# Altium schematic sheet NuPrism_MCPMT - ADA4945-1 and Filter - Rev2.SchDoc: NuPrism Multichannel PMT - ADA4932-1 and Filter
size A; DrawnBy: D.Bishop; DocumentNumber: 8; Revision: 2; SheetNumber: 8; SheetTotal: 20
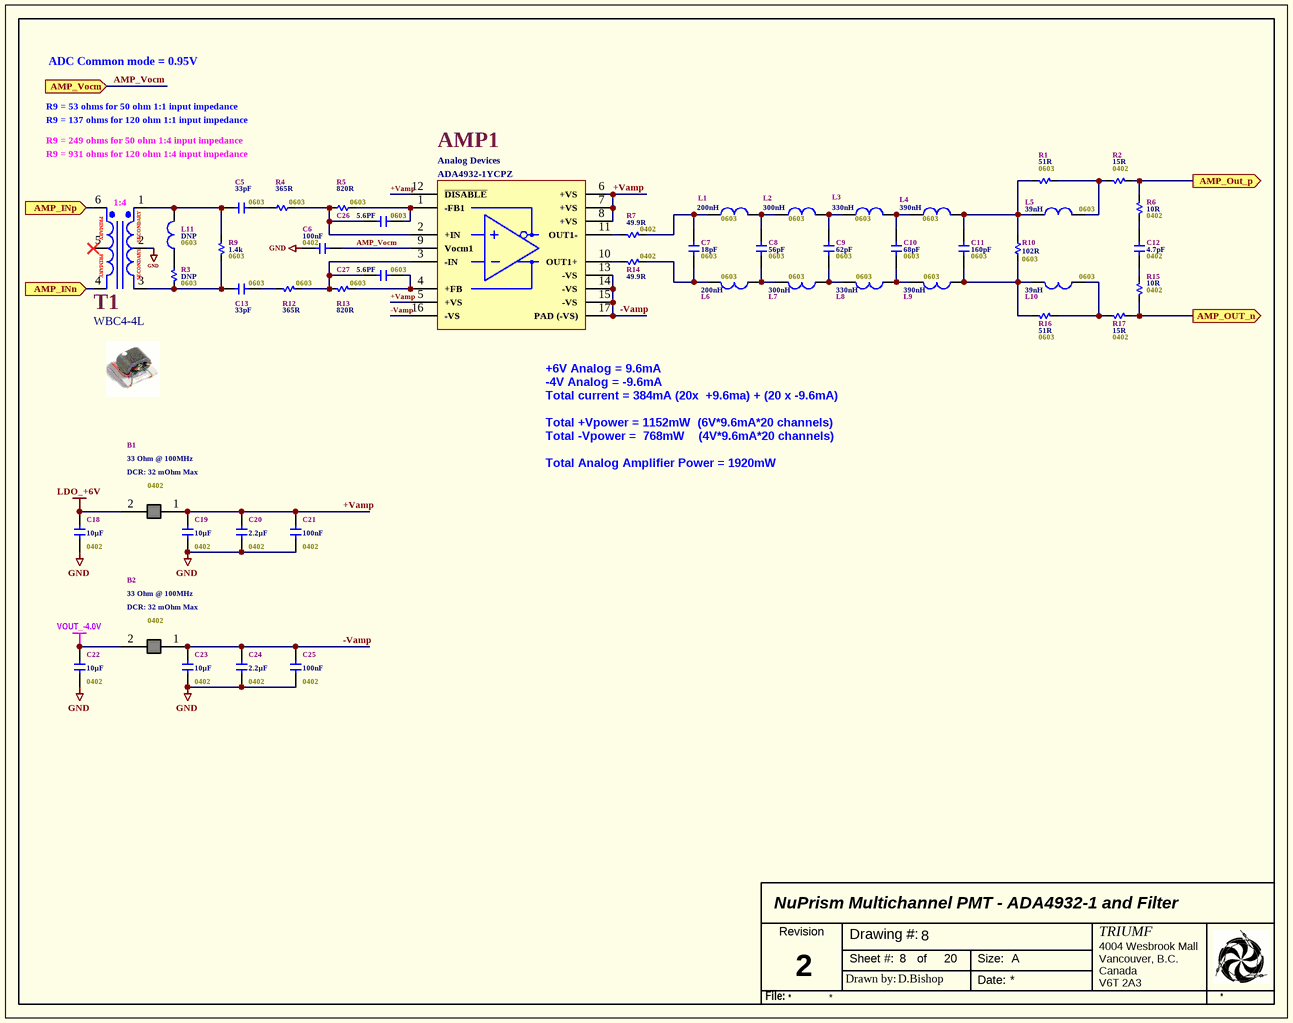
[diagram p0: NuPrism_MCPMT - ADA4945-1 and Filter - Rev2.SchDoc]

## Parts
AMP1  Manufacturer: Analog Devices  [QFN50P300X300X100-16N_ALT]  (hidden comment: ADA4932-1YCPZ)
B1  DCR: 32 mOhm Max  Impedance @ Frequency: 33 Ohm @ 100MHz  [0402]  (hidden comment: BLM15PX600SN1D)
B2  DCR: 32 mOhm Max  Impedance @ Frequency: 33 Ohm @ 100MHz  [0402]  (hidden comment: BLM15PX600SN1D)
C5  Capacitance: 33pF  [0603]  (hidden comment: C0603C330J1GAC7867)
C6  Capacitance: 100nF  [0402]  (hidden comment: C0402C104K4RACTU)
C7  Capacitance: 18pF  [0603]  (hidden comment: CC0603JPNPO9BN180)
C8  Capacitance: 56pF  [0603]  (hidden comment: C0603C560J5GAC7867)
C9  Capacitance: 62pF  [0603]  (hidden comment: CC0603JRNPO9BN620)
C10  Capacitance: 68pF  [0603]  (hidden comment: CC0603JRNPO9BN680)
C11  Capacitance: 160pF  [0603]  (hidden comment: CC0603JRNPO9BN161)
C12  Capacitance: 4.7pF  [0402]  (hidden comment: CC0402BRNPO9BN4R7)
C13  Capacitance: 33pF  [0603]  (hidden comment: C0603C330J1GAC7867)
C18  Capacitance: 10µF  [0402]  (hidden comment: CL05A106MQ5NRNC)
C19  Capacitance: 10µF  [0402]  (hidden comment: CL05A106MQ5NRNC)
C20  Capacitance: 2.2µF  [0402]  (hidden comment: TMK105CBJ225KV-F)
C21  Capacitance: 100nF  [0402]  (hidden comment: C0402C104K4RACTU)
C22  Capacitance: 10µF  [0402]  (hidden comment: CL05A106MQ5NRNC)
C23  Capacitance: 10µF  [0402]  (hidden comment: CL05A106MQ5NRNC)
C24  Capacitance: 2.2µF  [0402]  (hidden comment: TMK105CBJ225KV-F)
C25  Capacitance: 100nF  [0402]  (hidden comment: C0402C104K4RACTU)
C26  Capacitance: 5.6PF  [0603]  (hidden comment: 06035A5R6JAT2A)
C27  Capacitance: 5.6PF  [0603]  (hidden comment: 06035A5R6JAT2A)
L1  Package: 0603  Inductance: 200nH  [0603 - Inductor]  (hidden comment: LQW18ANR20J8ZD)
L2  Package: 0603  Inductance: 300nH  [0603 - Inductor]  (hidden comment: LQW18ANR30G80D)
L3  Package: 0603  Inductance: 330nH  [0603 - Inductor]  (hidden comment: LQW18CNR33J00D)
L4  Package: 0603  IndUctance: 390nH  [0603 - inductor]  (hidden comment: MLJ1608WR39JT000)
L5  Package: 0603  Inductance: 39nH  [0603 - Inductor_2]  (hidden comment: LQW18AN39NJ00D)
L6  Package: 0603  Inductance: 200nH  [0603 - Inductor]  (hidden comment: LQW18ANR20J8ZD)
L7  Package: 0603  Inductance: 300nH  [0603 - Inductor]  (hidden comment: LQW18ANR30G80D)
L8  Package: 0603  Inductance: 330nH  [0603 - Inductor]  (hidden comment: LQW18CNR33J00D)
L9  Package: 0603  Inductance: 390nH  [0603 - inductor]  (hidden comment: MLJ1608WR39JT000)
L10  Package: 0603  Inductance: 39nH  [0603 - Inductor_2]  (hidden comment: LQW18AN39NJ00D)
L11  Package: 0603  Inductance: DNP  [0603 - Inductor]
R1  Resistance: 51R  [0603]  (hidden comment: RC0603FR-0751RL)
R2  Resistance: 15R  [0402]  (hidden comment: RMCF0402FT15R0)
R3  Resistance: DNP  [0603]
R4  Resistance: 365R  [0603]  (hidden comment: ERJ-PB3B3650V)
R5  Resistance: 820R  [0603]  (hidden comment: RT0603BRD07820RL)
R6  Resistance: 10R  [0402]  (hidden comment: RC0402FR-0710RL)
R7  Resistance: 49.9R  [0402]  (hidden comment: RMCF0402FT49R9)
R9  Resistance: 1.4k  [0603]  (hidden comment: RC0603FR-101K4L)
R10  Resistance: 102R  [0603]  (hidden comment: RC0603FR-07102RL)
R12  Resistance: 365R  [0603]  (hidden comment: ERJ-PB3B3650V)
R13  Resistance: 820R  [0603]  (hidden comment: RT0603BRD07820RL)
R14  Resistance: 49.9R  [0402]  (hidden comment: RMCF0402FT49R9)
R15  Resistance: 10R  [0402]  (hidden comment: RC0402FR-0710RL)
R16  Resistance: 51R  [0603]  (hidden comment: RC0603FR-0751RL)
R17  Resistance: 15R  [0402]  (hidden comment: RMCF0402FT15R0)
T1  WBC4-4L  [WBC4-4WL]

## Ports
AMP_INn (in), AMP_INp (in), AMP_OUT_n (out), AMP_Out_p (out), AMP_Vocm (in)

## Nets
GND: C6.1 C18.1 C19.1 C20.2 C21.2 C22.1 C23.1 C24.2 C25.2 T1.2(SecCT)
LDO_+6V: B1.2 C18.2
VOUT_-4.0V: B2.2 C22.2
+Vamp: AMP1.5(+VS) AMP1.6(+VS) AMP1.7(+VS) AMP1.8(+VS) AMP1.12(~{DISABLE}) B1.1 C19.2 C20.1 C21.1
-Vamp: AMP1.13(-VS) AMP1.14(-VS) AMP1.15(-VS) AMP1.16(-VS) AMP1.17(PAD_(-VS)) B2.1 C23.2 C24.1 C25.1
AMP_INn: T1.4(Pri-) ; port AMP_INn
AMP_INp: T1.6(Pri+) ; port AMP_INp
AMP_OUT_n: R15.1 R17.2 ; port AMP_OUT_n
AMP_Out_p: R2.2 R6.2 ; port AMP_Out_p
AMP_Vocm: AMP1.9(Vocm1) C6.2 ; port AMP_Vocm
NetAMP1_1: AMP1.1(-FB1) C26.1 R5.1
NetAMP1_2: AMP1.2(+IN) C26.2 R4.1 R5.2
NetAMP1_3: AMP1.3(-IN) C27.2 R12.1 R13.2
NetAMP1_4: AMP1.4(+FB) C27.1 R13.1
NetAMP1_10: AMP1.10(OUT1+) R14.2
NetAMP1_11: AMP1.11(OUT1-) R7.2
NetC5_1: C5.1 L11.2 R9.1 T1.1(Sec+)
NetC5_2: C5.2 R4.2
NetC7_1: C7.1 L6.1 R14.1
NetC7_2: C7.2 L1.1 R7.1
NetC8_1: C8.1 L6.2 L7.1
NetC8_2: C8.2 L1.2 L2.1
NetC9_1: C9.1 L7.2 L8.1
NetC9_2: C9.2 L2.2 L3.1
NetC10_1: C10.1 L8.2 L9.1
NetC10_2: C10.2 L3.2 L4.1
NetC11_1: C11.1 L9.2 L10.1 R10.2 R16.1
NetC11_2: C11.2 L4.2 L5.1 R1.1 R10.1
NetC12_1: C12.1 R15.2
NetC12_2: C12.2 R6.1
NetC13_1: C13.1 R3.2 R9.2 T1.3(Sec-)
NetC13_2: C13.2 R12.2
NetL5_2: L5.2 R1.2 R2.1
NetL10_2: L10.2 R16.2 R17.1
NetL11_1: L11.1 R3.1

Not connected (* = marked no-connect by the designer): T1 5(PriCT)*

## Notes on the sheet
- ADC Common mode = 0.95V
- R9 = 249 ohms for 50 ohm 1:4 input impedance
- R9 = 931 ohms for 120 ohm 1:4 input impedance
- R9 = 53 ohms for 50 ohm 1:1 input impedance
- R9 = 137 ohms for 120 ohm 1:1 input impedance
- (near AMP1) +6V Analog = 9.6mA
- Total +Vpower = 1152mW  (6V*9.6mA*20 channels)
- Total current = 384mA (20x  +9.6ma) + (20 x -9.6mA)
- -4V Analog = -9.6mA
- Total -Vpower =  768mW    (4V*9.6mA*20 channels)
- Total Analog Amplifier Power = 1920mW
- Revision
- Sheet #:
- Drawing #:
- of
- Size:
- A
- TRIUMF
- 4004 Wesbrook Mall
- Vancouver, B.C.
- Canada
- File:
- Drawn by:
- Date:
- V6T 2A3
- (in symbol WBC4-4L) 1:4; PRIMARY; SECONDARY

## Library data of the parts
AMP1 = ADA4932-1YCPZ_ALT: High Speed, ±0.1 µV/˚C Offset Drift, Fully Differential ADC Driver; PartNo: ADA4932-1YCPZ; Family: Semiconductor
B1 B2 = Ferrite Bead: 60 Ohms @ 100MHz Ferrite Bead 0402 2.5A; Manufacturer: Murata; Package: 0402; PartNo: BLM15PX600SN1D; Family: Bead; Case Code (Imperial): 0402; Case Code (Metric): 1005
C5 C13 = CAP-SMALL: 33 pF ±5% 100V Ceramic Capacitor C0G, NP0 0603; Manufacturer: KEMET; Package: 0603; Voltage: 100V; PartNo: C0603C330J1GAC7867; Case Code (Imperial): 0603; Family: Capacitor; Case Code (Metric): 1608; DB_On_Order: DigiKey 8000
C6 C21 C25 = CAP-SMALL: SMD/SMT 0402 16V 0.1uF X7R 10%; Manufacturer: Kemet; Package: 0402; Voltage: 16V; PartNo: C0402C104K4RACTU; Case Code (Imperial): 0402; Family: Capacitor; Case Code (Metric): 1005
C7 = CAP-SMALL: 18 pF ±5% 50V Ceramic Capacitor C0G, NP0 0603; Manufacturer: Yageo; Package: 0603; PartNo: CC0603JPNPO9BN180; Case Code (Imperial): 0603; Family: Capacitor; Case Code (Metric): 1608; Supplier 1: Digi-Key; Supplier Part Number 1: 13-CC0603JPNPO9BN180TR-ND; Voltage: 50V; DB_On_Order: DigiReel 2300
C8 = CAP-SMALL: 56 pF ±5% 50V Ceramic Capacitor C0G, NP0 0603 (1608 Metric); Manufacturer: KEMET; Package: 0603; PartNo: C0603C560J5GAC7867; Case Code (Imperial): 0603; Family: Capacitor; Case Code (Metric): 1608; Voltage: 50V; DB_On_Order: DigiKey 4000
C9 = CAP-SMALL: 62 pF ±5% 50V Ceramic Capacitor C0G, NP0 0603 (1608 Metric); Manufacturer: YAGEO; Package: 0603; PartNo: CC0603JRNPO9BN620; Case Code (Imperial): 0603; Family: Capacitor; Case Code (Metric): 1608; Voltage: 50V; DB_On_Order: DigiReel 2300
C10 = CAP-SMALL: CAP CER 68PF 50V C0G/NPO 0603 (1608 Metric); Manufacturer: Yageo; Package: 0603; PartNo: CC0603JRNPO9BN680; Case Code (Imperial): 0603; Family: Capacitor; Case Code (Metric): 1608; Voltage: 50V
C11 = CAP-SMALL: 160 pF ±5% 50V Ceramic Capacitor C0G, NP0 0603 (1608 Metric); Manufacturer: YAGEO; Package: 0603; PartNo: CC0603JRNPO9BN161; Case Code (Imperial): 0603; Family: Capacitor; Case Code (Metric): 1608; Voltage: 50V; DB_On_Order: DigiReel 2300
C12 = CAP-SMALL: 4.7pF ±0.1pF 50V Ceramic Capacitor C0G, NP0 0402; Manufacturer: Yageo; Package: 0402; Voltage: 50V; PartNo: CC0402BRNPO9BN4R7; Family: Capacitor; Case Code (Imperial): 0402; Case Code (Metric): 1005
C18 C19 C22 C23 = ECJ2FB1A106K: 10 µF ±20% 6.3V Ceramic Capacitor X5R 0402 (1005 Metric); Manufacturer: Samsung Electro-Mechanics; Package: 0402; Voltage: 6.3V; PartNo: CL05A106MQ5NRNC; Family: Capacitor; Case Code (Imperial): 0402; Case Code (Metric): 1005
C20 C24 = CAP-SMALL: SMD/SMT 0402 25V 2.2uF 10% X5R; Manufacturer: Taiyo Yuden; Package: 0402; Voltage: 25V; PartNo: TMK105CBJ225KV-F; Family: Capacitor; Case Code (Imperial): 0402; Case Code (Metric): 1005
C26 C27 = CAP-SMALL: 5.6 pF ±5% 50V Ceramic Capacitor C0G, NP0 0603; Manufacturer: KYOCERA AVX; PartNo: 06035A5R6JAT2A; Case Code (Imperial): 0603; Package: 0603; Family: Capacitor; Voltage: 50V; Case Code (Metric): 1608; DB_On_Order: DigiKey 4300
L1 L6 = Inductor1: 200 nH Unshielded Wirewound Inductor 120 mA 2.40Ohm Max 0603; Manufacturer: Murata Electronics; PartNo: LQW18ANR20G00D; DCR: 1.74; DB_On_Order: Check if DCR is OK (Digi-Key); Family: Inductor; Case Code (Imperial): 0603; Case Code (Metric): 1608
L2 L7 = Inductor1: 300 nH Unshielded Wirewound Inductor 220 mA 3.12Ohm Max 0603; Manufacturer: Coilcraft; PartNo: LQW18ANR30G8ZD; DB_On_Order: Check if DCR is OK (Mouser); Family: Inductor; DCR: 3.12 Ohm; Case Code (Imperial): 0603; Case Code (Metric): 1608
L3 L8 = Inductor1: 330 nH Unshielded Drum Core, Wirewound Inductor 630 mA 250mOhm Max 0603; Manufacturer: Murata Electronics; PartNo: LQW18CNR33J00D; Family: Inductor; DCR: 250 mOhm; Case Code (Imperial): 0603; Case Code (Metric): 1608; DB_On_Order: DigiKey 4300
L4 L9 = Inductor1: 390 nH Shielded Multilayer Inductor 450 mA 364mOhm Max 0603 (1608 Metric); Manufacturer: TDK Corporation; PartNo: MLJ1608WR39JT000; Family: Inductor; DCR: 364 mOhm Max; Case Code (Imperial): 0603; Case Code (Metric): 1608; DB_On_Order: DigiKey 4300
L5 L10 = Inductor1: 39 nH Unshielded Wirewound Inductor 400 mA 260mOhm Max 0603 (1608 Metric); Manufacturer: Murata Electronics; PartNo: LQW18AN39NJ00D; Family: Inductor; Case Code (Imperial): 0603; Case Code (Metric): 1608; DB_On_Order: DigiKey 4300
L11 = Inductor1: Do not put; DCR: 60m Ohm Max; Family: Inductor; Case Code (Imperial): 0603; Case Code (Metric): 1608; DB_On_Order: DigiReel 2300
R1 R16 = RES-TINY: Thick Film Resistors - SMD 51 OHM 1%; Manufacturer: Yageo; Package: 0603; PartNo: RC0603FR-0751RL; Family: Resistor; Case Code (Imperial): 0603; Case Code (Metric): 1608
R2 R17 = RES-TINY: 15 Ohms ±1% 0.063W, 1/16W Chip Resistor 0402 (1005 Metric); Manufacturer: Stackpole Electronics Inc; Package: 0402; PartNo: RMCF0402FT15R0; Family: Resistor; Case Code (Imperial): 0402; Case Code (Metric): 1005
R3 = RES-TINY: Do not put; Manufacturer: Yageo; PartNo: RT0603BRD07820RL; DB_On_Order: Full+DigiReel - 6500; Package: 0603; Family: Resistor; Case Code (Imperial): 0603; Case Code (Metric): 1608
R4 R12 = RES-TINY: Thick Film Resistors - SMD 0603 Anti-Surge Res. 0.1%, 365ohm; Manufacturer: Panasonic; Package: 0603; PartNo: ERJ-PB3B3650V; Family: Resistor; Case Code (Imperial): 0603; Case Code (Metric): 1608; DB_On_Order: Mouser - 5000
R5 R13 = RES-TINY: 820 Ohms ±0.1% 0.1W, 1/10W Chip Resistor 0603 (1608 Metric) Thin Film; Manufacturer: Yageo; DB_On_Order: Full+DigiReel - 6500; Package: 0603; PartNo: RT0603BRD07820RL; Family: Resistor; Case Code (Imperial): 0603; Case Code (Metric): 1608
R6 R15 = RES-TINY: 10 Ohms ±1% 0.063W, 1/16W Chip Resistor 0402; Manufacturer: Yageo; Power Rating: 63mW; Voltage: 50V; Package: 0402; PartNo: RC0402FR-0710RL; Family: Resistor; Case Code (Imperial): 0402; Case Code (Metric): 1005
R7 R14 = RES-TINY: 49.9 Ohms ±1% 0.063W, 1/16W Chip Resistor 0402 (1005 Metric); Manufacturer: Stackpole Electronics Inc; Package: 0402; PartNo: RMCF0402FT49R9; Family: Resistor; Case Code (Imperial): 0402; Case Code (Metric): 1005
R9 = RES-TINY: 1.4 kOhms ±1% 0.1W, 1/10W Chip Resistor 0603 (1608 Metric) Thick Film; Manufacturer: Stackpole; PartNo: RC0603FR-101K2L; Package: 0603; Family: Resistor; Case Code (Imperial): 0603; Case Code (Metric): 1608
R10 = RES-TINY: 102 Ohms ±1% 0.1W, 1/10W Chip Resistor 0603; Manufacturer: Yageo; Package: 0603; PartNo: RC0603FR-07102RL; Family: Resistor; Case Code (Imperial): 0603; Case Code (Metric): 1608; DB_On_Order: DigiKey 5000
T1 = WBC4-4L: Audio Transformers / Signal Transformers WBC SMT Mini Wdebnd 1:4 0.250-800 MHz; Manufacturer: Coilcraft; Maximum DC Resistance:: 60m ohms / 120m oms; Inductance: Pri: 9.uH  Sec: 36uH; Package: WBC4-4L; Supplier 1: Mouser; Supplier Part Number 1: 994-WBC4-4LC; Family: Transformer; PartNo: WBC4-4L